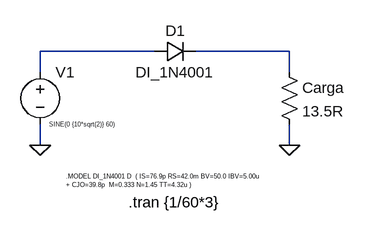
[diagram p0: schematic Diodo 1N4001 Retificador Meia Onda.asc]
Diodo 1N4001 Retificador Meia Onda.asc, the LTspice schematic file:
Version 4
SHEET 1 880 680
WIRE 32 0 -144 0
WIRE 240 0 96 0
WIRE -144 32 -144 0
WIRE 240 32 240 0
WIRE -144 144 -144 112
WIRE 240 144 240 112
FLAG -144 144 0
FLAG 240 144 0
SYMBOL diode 32 16 R270
WINDOW 0 32 32 VTop 2
WINDOW 3 0 32 VBottom 2
SYMATTR InstName D1
SYMATTR Value DI_1N4001
SYMBOL voltage -144 16 R0
WINDOW 3 14 96 Left 0
WINDOW 123 0 0 Left 0
WINDOW 39 0 0 Left 0
SYMATTR Value SINE(0 {10*sqrt(2)} 60)
SYMATTR InstName V1
SYMBOL res 224 16 R0
SYMATTR InstName Carga
SYMATTR Value 13.5R
TEXT -8 232 Left 2 !.tran {1/60*3}
TEXT -104 192 Left 0 !.MODEL DI_1N4001 D  ( IS=76.9p RS=42.0m BV=50.0 IBV=5.00u\n+ CJO=39.8p  M=0.333 N=1.45 TT=4.32u )

The netlist it stands for:
* Diodo 1N4001 Retificador Meia Onda.asc
D1 N001 N002 DI_1N4001
V1 N001 0 SINE(0 {10*sqrt(2)} 60)
R§Carga N002 0 13.5R
.model D D
.lib standard.dio
.tran {1/60*3}
.MODEL DI_1N4001 D  ( IS=76.9p RS=42.0m BV=50.0 IBV=5.00u
+ CJO=39.8p  M=0.333 N=1.45 TT=4.32u )
.backanno
.end